# Altium schematic sheet SpinASM.SchDoc
size A
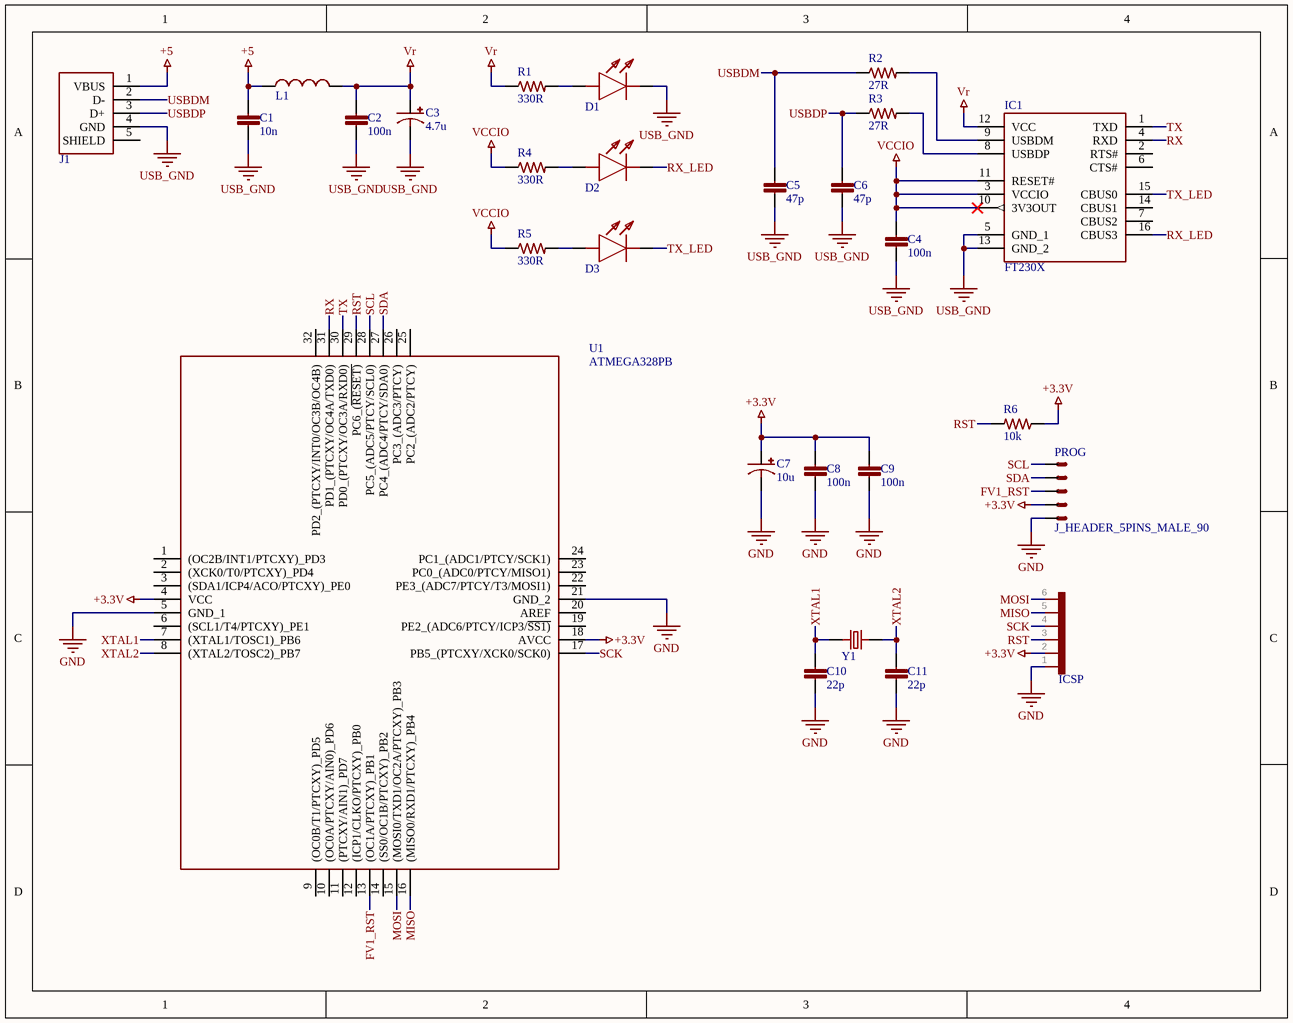
[diagram p0: SpinASM.SchDoc]

## Parts
C1  10n  [CHIP_0603]
C2  100n  [CHIP_0603]
C3  4.7u  [TAN_1206]
C4  100n  [CHIP_0603]
C5  47p  [CHIP_0603]
C6  47p  [CHIP_0603]
C7  10u  [TAN_1206]
C8  100n  [CHIP_0603]
C9  100n  [CHIP_0603]
C10  22p  [CHIP_0603]
C11  22p  [CHIP_0603]
D1  MP001249  [LED_0603]  (value not drawn)
D2  MP001249  [LED_0603]  (value not drawn)
D3  MP001249  [LED_0603]  (value not drawn)
IC1  FT230X  [TSSOP-16]
ICSP  ICSP  [AVRISP_POGO]  (value not drawn)
J1  USB_MALE  [USB_MALE]  (value not drawn)
L1  BLM18AG331SN1D  [INDC1608X10]  (value not drawn)
PROG  J_HEADER_5PINS_MALE_90  [HEADER_5PINS_MALE_90]
R1  330R  [CHIP_R_0603]
R2  27R  [CHIP_R_0603]
R3  27R  [CHIP_R_0603]
R4  330R  [CHIP_R_0603]
R5  330R  [CHIP_R_0603]
R6  10k  [CHIP_R_0603]
U1  ATMEGA328PB  [TQFP32]
Y1  ABM10  [ABM10-167]  (value not drawn)

## Nets
+3.3V: C7.+ C8.1 C9.1 ICSP.2(MOSI) PROG.2(S) R6.1 U1.4(VCC) U1.18(AVCC)
+5: C1.1 J1.1(VBUS) L1.2
GND: C7.- C8.2 C9.2 C10.2 C11.2 ICSP.1(~{RST}) PROG.1(S) U1.5(GND_1) U1.21(GND_2)
USB_GND: C1.2 C2.2 C3.- C4.2 C5.2 C6.2 D1.1(K) IC1.5(GND_1) IC1.13(GND_2) J1.4(GND)
VCCIO: C4.1 IC1.3(VCCIO) IC1.10(3V3OUT) IC1.11(RESET#) R4.1 R5.1
Vr: C2.1 C3.+ IC1.12(VCC) L1.1 R1.1
FV1_RST: PROG.3(S) U1.13((OC1A/PTCXY)_PB1)
MISO: ICSP.5(GND) U1.16((MISO0/RXD1/PTCXY)_PB4)
MOSI: ICSP.6(VCC) U1.15((MOSI0/TXD1/OC2A/PTCXY)_PB3)
RST: ICSP.3(MISO) R6.2 U1.29(PC6_(~{RESET)})
RX: IC1.4(RXD) U1.31(PD1_(PTCXY/OC4A/TXD0))
RX_LED: D2.1(K) IC1.16(CBUS3)
SCK: ICSP.4(SCK) U1.17(PB5_(PTCXY/XCK0/SCK0))
SCL: PROG.5(S) U1.28(PC5_(ADC5/PTCY/SCL0))
SDA: PROG.4(S) U1.27(PC4_(ADC4/PTCY/SDA0))
TX: IC1.1(TXD) U1.30(PD0_(PTCXY/OC3A/RXD0))
TX_LED: D3.1(K) IC1.15(CBUS0)
USBDM: C5.1 J1.2(D-) R2.1
USBDP: C6.1 J1.3(D+) R3.1
XTAL1: C10.1 U1.7((XTAL1/TOSC1)_PB6) Y1.1
XTAL2: C11.1 U1.8((XTAL2/TOSC2)_PB7) Y1.2
NetD1_2: D1.2(A) R1.2
NetD2_2: D2.2(A) R4.2
NetD3_2: D3.2(A) R5.2
NetIC1_8: IC1.8(USBDP) R3.2
NetIC1_9: IC1.9(USBDM) R2.2

Not connected (* = marked no-connect by the designer): IC1 2(RTS#) 6(CTS#) 7(CBUS2) 14(CBUS1); J1 5(SHIELD); U1 1((OC2B/INT1/PTCXY)_PD3) 2((XCK0/T0/PTCXY)_PD4) 3((SDA1/ICP4/ACO/PTCXY)_PE0) 6((SCL1/T4/PTCXY)_PE1) 9((OC0B/T1/PTCXY)_PD5) 10((OC0A/PTCXY/AIN0)_PD6) 11((PTCXY/AIN1)_PD7) 12((ICP1/CLKO/PTCXY)_PB0) 14((SS0/OC1B/PTCXY)_PB2) 19(PE2_(ADC6/PTCY/ICP3/~{SS1)}) 20(AREF) 22(PE3_(ADC7/PTCY/T3/MOSI1)) 23(PC0_(ADC0/PTCY/MISO1)) 24(PC1_(ADC1/PTCY/SCK1)) 25(PC2_(ADC2/PTCY)) 26(PC3_(ADC3/PTCY)) 32(PD2_(PTCXY/INT0/OC3B/OC4B))

## Library data of the parts
C1 = MC0603B103K500CT: CAP CER 10NF 50V X7R 0603; Manufacturer: Multicomp; Tolerance: 10%; Supplier 1: Farnell; Supplier Part Number 1: 1759102; Manufacturer Part Number: MC0603B103K500CT; RoHS: Yes; Category: Ceramic Capacitors; Stock 1: 112880; Case/Package: 0603; Number of Pins: 2; Case Code (Metric): 1608; Case Code (Imperial): 0603; Min Operating Temperature: -55°C; Max Operating Temperature: 125°C; Voltage Rating (DC): 50V; Dielectric: X7R; Capacitance: 10nF; Voltage Rating: 50V; Packaging: Tape and Reel; Width: 0.8mm; REACH SVHC: Unknown; ComponentLink1URL: https://datasheet.ciiva.com/22675/1901289-22675356.pdf?src-supplier=Element14; ComponentLink1Description: https://datasheet.ciiva.com/22675/1901289-22675356.pdf?src-supplier=Element14; ComponentLink2URL: https://datasheet.ciiva.com/22675/1901289-22675357.pdf?src-supplier=Element14; ComponentLink2Description: https://datasheet.ciiva.com/22675/1901289-22675357.pdf?src-supplier=Element14; Price: 0.0147
C2 C4 C8 C9 = MC0603B104K500CT: CAP CER 100NF 50V X7R 0603; Manufacturer: Multicomp; Tolerance: 10%; Supplier 1: Farnell; Supplier Part Number 1: 1759122; Manufacturer Part Number: MC0603B104K500CT; Stock 1: 1057763; RoHS: Yes; Case/Package: 0603; Number of Pins: 2; Case Code (Metric): 1608; Case Code (Imperial): 0603; Min Operating Temperature: -55°C; Max Operating Temperature: 125°C; Packaging: Cut Tape; Voltage Rating: 50V; Capacitance: 100nF; Dielectric: X7R; Voltage Rating (DC): 50V; REACH SVHC: Unknown; ComponentLink1URL: https://datasheet.ciiva.com/22686/1901289-22686278.pdf?src-supplier=Element14; ComponentLink1Description: https://datasheet.ciiva.com/22686/1901289-22686278.pdf?src-supplier=Element14; ComponentLink2URL: https://datasheet.ciiva.com/22686/1901289-22686279.pdf?src-supplier=Element14; ComponentLink2Description: https://datasheet.ciiva.com/22686/1901289-22686279.pdf?src-supplier=Element14; ComponentLink3URL: https://datasheet.ciiva.com/22648/1901289-22648411.pdf?src-supplier=Element14; ComponentLink3Description: https://datasheet.ciiva.com/22648/1901289-22648411.pdf?src-supplier=Element14; Price: 0.0458
C3 = T491A475K010AT: CAP TANT 4.7UF 10V; Manufacturer: KEMET; Dielectric Material: Tantalum; Tolerance: 20%; ESR (Equivalent Series Resistance): 5R; Life (Hours): 2000Hour; Leakage Current: 500nA; Dissipation Factor: 6%; Polarity: Polar; Ripple Current: 122mA; Supplier 1: Farnell; Supplier Part Number 1: 1457427; Manufacturer Part Number: T491A475K010AT; RoHS: Yes; Category: Tantalum Capacitors; Stock 1: 5135; Mount: Surface Mount,PCB; Case/Package: 1206; Number of Pins: 2; Case Code (Metric): 3216; Case Code (Imperial): 1206; Min Operating Temperature: -55°C; Max Operating Temperature: 125°C; Capacitance: 4.7uF; Packaging: Tape and Reel; Voltage Rating: 10V; Features: General Purpose; Termination: SMD/SMT; Voltage Rating (DC): 10V; Voltage: 10V; Package Quantity: 1; Length: 3.2mm; Height: 1.6mm; Depth: 1.6mm; Width: 1.6mm; Height - Seated (Max): 0.071inch; Lead Pitch: 1.2mm; Radiation Hardening: No; Lead Free: Lead Free; REACH SVHC: No SVHC; ComponentLink1URL: https://datasheet.ciiva.com/257/kem-t2005-t491-257408.pdf?src-supplier=Digi-Key; ComponentLink1Description: https://datasheet.ciiva.com/257/kem-t2005-t491-257408.pdf?src-supplier=Digi-Key; ComponentLink2URL: https://datasheet.ciiva.com/7668/1732747-7668019.pdf?src-supplier=Element14; ComponentLink2Description: https://datasheet.ciiva.com/7668/1732747-7668019.pdf?src-supplier=Element14; ComponentLink3URL: https://datasheet.ciiva.com/27052/1573417-27052564.pdf?src-supplier=Jameco; ComponentLink3Description: https://datasheet.ciiva.com/27052/1573417-27052564.pdf?src-supplier=Jameco; ComponentLink4URL: https://datasheet.ciiva.com/14589/70095774-14589016.pdf?src-supplier=Allied+Electronics; ComponentLink4Description: https://datasheet.ciiva.com/14589/70095774-14589016.pdf?src-supplier=Allied+Electronics; ComponentLink5URL: https://datasheet.ciiva.com/257/kem-t2005-t491-257409.pdf?src-supplier=Digi-Key; ComponentLink5Description: https://datasheet.ciiva.com/257/kem-t2005-t491-257409.pdf?src-supplier=Digi-Key; ComponentLink6URL: https://datasheet.ciiva.com/7668/1446014-7668021.pdf?src-supplier=Element14; ComponentLink6Description: https://datasheet.ciiva.com/7668/1446014-7668021.pdf?src-supplier=Element14; ComponentLink7URL: https://datasheet.ciiva.com/14588/70095774-14588348.pdf?src-supplier=Allied+Electronics; ComponentLink7Description: https://datasheet.ciiva.com/14588/70095774-14588348.pdf?src-supplier=Allied+Electronics; ComponentLink8URL: https://datasheet.ciiva.com/257/kem-t2005-t491-257407.pdf?src-supplier=Digi-Key; ComponentLink8Description: https://datasheet.ciiva.com/257/kem-t2005-t491-257407.pdf?src-supplier=Digi-Key; Price: 0.241
C5 C6 = MC0603N470J500CT: CAP CER 47PF 50V C0G/NP0 0603; Manufacturer: Multicomp; Tolerance: 5%; Dielectric: C0G; Temperature Coefficient: 30ppm/°C; Supplier 1: Farnell; Supplier Part Number 1: 1759062; Manufacturer Part Number: MC0603N470J500CT; Stock: 148629; Pricing: 10=0.0246, 100=0.0199, 500=0.0123, 1000=0.0097, 2000=0.0089 (EUR); RoHS: Yes; Case/Package: 0603; Number of Pins: 2; Case Code (Metric): 1608; Case Code (Imperial): 0603; Min Operating Temperature: -55°C; Max Operating Temperature: 125°C; Packaging: Tape and Reel; Voltage Rating: 50V; Capacitance: 47pF; Voltage Rating (DC): 50V; Width: 0.8mm; REACH SVHC: Unknown; ComponentLink1URL: https://datasheet.ciiva.com/22648/1901289-22648503.pdf?src-supplier=Element14; ComponentLink1Description: https://datasheet.ciiva.com/22648/1901289-22648503.pdf?src-supplier=Element14; ComponentLink2URL: https://datasheet.ciiva.com/22682/1901289-22682812.pdf?src-supplier=Element14; ComponentLink2Description: https://datasheet.ciiva.com/22682/1901289-22682812.pdf?src-supplier=Element14; ComponentLink3URL: https://datasheet.ciiva.com/22682/1901289-22682813.pdf?src-supplier=Element14; ComponentLink3Description: https://datasheet.ciiva.com/22682/1901289-22682813.pdf?src-supplier=Element14; Price: 0.02
C7 = T491A106K016AT: CAP TANT 10UF 16V; Manufacturer: KEMET; Dielectric Material: Tantalum; Tolerance: 10%; ESR (Equivalent Series Resistance): 7R; Life (Hours): 2000Hour; Polarity: Polar; Leakage Current: 1.6uA; Ripple Current: 104mA; Supplier 1: Farnell; Supplier Part Number 1: 1457414; Manufacturer Part Number: T491A106K016AT; RoHS: Yes; Category: Tantalum Capacitors; Stock: 36020; Pricing: 5=0.30300, 50=0.16000, 250=0.13300, 500=0.12000, 1000=0.10200 (EUR); Mount: Surface Mount,PCB; Case/Package: 1206; Number of Pins: 2; Case Code (Metric): 3216; Case Code (Imperial): 1206; Min Operating Temperature: -55°C; Max Operating Temperature: 125°C; Capacitance: 10uF; Packaging: Tape and Reel; Voltage Rating: 16V; Features: General Purpose; Dissipation Factor: 10%; Package Quantity: 1; Voltage Rating (DC): 16V; Termination: SMD/SMT; Failure Rate: 0.001%; Voltage: 16V; Length: 3.2mm; Height: 1.6mm; Width: 1.6mm; Depth: 1.6mm; Height - Seated (Max): 0.071inch; Lead Pitch: 1.2mm; Radiation Hardening: No; Lead Free: Lead Free; REACH SVHC: No SVHC; ComponentLink1URL: https://datasheet.ciiva.com/7696/1732745-7696294.pdf?src-supplier=Element14; ComponentLink1Description: https://datasheet.ciiva.com/7696/1732745-7696294.pdf?src-supplier=Element14; ComponentLink2URL: https://datasheet.ciiva.com/34302/1573257-34302505.pdf?src-supplier=Jameco; ComponentLink2Description: https://datasheet.ciiva.com/34302/1573257-34302505.pdf?src-supplier=Jameco; ComponentLink3URL: https://datasheet.ciiva.com/7696/1854511-7696293.pdf?src-supplier=Element14; ComponentLink3Description: https://datasheet.ciiva.com/7696/1854511-7696293.pdf?src-supplier=Element14; ComponentLink4URL: https://datasheet.ciiva.com/14586/70095774-14586694.pdf?src-supplier=Allied+Electronics; ComponentLink4Description: https://datasheet.ciiva.com/14586/70095774-14586694.pdf?src-supplier=Allied+Electronics; ComponentLink5URL: https://datasheet.ciiva.com/6248/kem-t2005-t491-6248087.pdf?src-supplier=Digi-Key; ComponentLink5Description: https://datasheet.ciiva.com/6248/kem-t2005-t491-6248087.pdf?src-supplier=Digi-Key; ComponentLink6URL: https://datasheet.ciiva.com/6248/kem-t2005-t491-6248088.pdf?src-supplier=Digi-Key; ComponentLink6Description: https://datasheet.ciiva.com/6248/kem-t2005-t491-6248088.pdf?src-supplier=Digi-Key; ComponentLink7URL: https://datasheet.ciiva.com/14113/t491serie-eng-tds-14113132.pdf?src-supplier=Distrelec; ComponentLink7Description: https://datasheet.ciiva.com/14113/t491serie-eng-tds-14113132.pdf?src-supplier=Distrelec; ComponentLink8URL: https://datasheet.ciiva.com/7696/1923792-7696431.pdf?src-supplier=Element14; ComponentLink8Description: https://datasheet.ciiva.com/7696/1923792-7696431.pdf?src-supplier=Element14; ComponentLink9URL: https://datasheet.ciiva.com/7696/1854511-7696295.pdf?src-supplier=Element14; ComponentLink9Description: https://datasheet.ciiva.com/7696/1854511-7696295.pdf?src-supplier=Element14; ComponentLink10URL: https://datasheet.ciiva.com/14605/70095774-14605543.pdf?src-supplier=Allied+Electronics; ComponentLink10Description: https://datasheet.ciiva.com/14605/70095774-14605543.pdf?src-supplier=Allied+Electronics; ComponentLink11URL: https://datasheet.ciiva.com/7696/1446014-7696296.pdf?src-supplier=Element14; ComponentLink11Description: https://datasheet.ciiva.com/7696/1446014-7696296.pdf?src-supplier=Element14; ComponentLink12URL: https://datasheet.ciiva.com/6248/kem-t2005-t491-6248089.pdf?src-supplier=Digi-Key; ComponentLink12Description: https://datasheet.ciiva.com/6248/kem-t2005-t491-6248089.pdf?src-supplier=Digi-Key; ComponentLink13URL: https://datasheet.ciiva.com/12882/kem-t2005-t491-12882730.pdf?src-supplier=Mouser; ComponentLink13Description: https://datasheet.ciiva.com/12882/kem-t2005-t491-12882730.pdf?src-supplier=Mouser; ComponentLink14URL: https://datasheet.ciiva.com/39123/kem-t2005-t491-39123278.pdf?src-supplier=Onlinecomponents.com; ComponentLink14Description: https://datasheet.ciiva.com/39123/kem-t2005-t491-39123278.pdf?src-supplier=Onlinecomponents.com; ComponentLink15URL: https://datasheet.ciiva.com/29244/458306-da-01-de-kondensator-10uf-3216-10pr-16v-85c-29244588.pdf?src-supplier=Conrad; ComponentLink15Description: https://datasheet.ciiva.com/29244/458306-da-01-de-kondensator-10uf-3216-10pr-16v-85c-29244588.pdf?src-supplier=Conrad; Price: 0.167
C10 C11 = MC0603N220J500CT: CAP CER 22PF 50V C0G/NP0 0603; Manufacturer: Multicomp; Temperature Coefficient: 30ppm/°C; Dielectric: C0G; Tolerance: 5%; Supplier 1: Farnell; Supplier Part Number 1: 1759057; Manufacturer Part Number: MC0603N220J500CT; RoHS: Yes; Category: Ceramic Capacitors; Stock: 53792; Case/Package: 0603; Number of Pins: 2; Case Code (Imperial): 0603; Case Code (Metric): 1608; Min Operating Temperature: -55°C; Max Operating Temperature: 125°C; Voltage Rating (DC): 50V; Capacitance: 22pF; Voltage Rating: 50V; Packaging: Cut Tape; Width: 0.8mm; REACH SVHC: Unknown; ComponentLink1URL: https://datasheet.ciiva.com/22648/1901289-22648486.pdf?src-supplier=Element14; ComponentLink1Description: https://datasheet.ciiva.com/22648/1901289-22648486.pdf?src-supplier=Element14; Price: 0.024
D1-D3 = MP001249: LED RED CMS 603 20 mA 2.5 V 629 nm; Manufacturer: Multicomp; Supplier 1: Farnell; Supplier Part Number 1: 3265380; Manufacturer Part Number: MP001249; RoHS: No; Price: 0.0718
IC1 = FT230XS-R: USB-to-UART 1-CH 512byte FIFO 5V 16-Pin SSOP T/R; Manufacturer: FTDI; Data Rate: 12Mbps; Number of Channels: 1; Max Supply Voltage: 5.5V; Min Supply Voltage: 2.97V; Interface: UART,USB; Operating Supply Current: 8mA; Supplier 1: Farnell; Supplier Part Number 1: 2081321; Manufacturer Part Number: FT230XS-R; RoHS: Yes; Category: Interface ICs; Stock 1: 45264; Mount: Surface Mount; Case/Package: SSOP; Number of Pins: 16; Weight: 0.004586oz; Min Operating Temperature: -40°C; Max Operating Temperature: 85°C; Packaging: Tape and Reel; Package Quantity: 3000; Operating Supply Voltage: 5V; Length: 5mm; Height: 0.059inch; Width: 0.157inch; ComponentLink1URL: https://datasheet.ciiva.com/1787/ds-ft230x-1787315.pdf?src-supplier=Digi-Key; ComponentLink1Description: https://datasheet.ciiva.com/1787/ds-ft230x-1787315.pdf?src-supplier=Digi-Key; ComponentLink2URL: https://datasheet.ciiva.com/4787/ds-ft230x-5395-4787571.pdf?src-supplier=Mouser; ComponentLink2Description: https://datasheet.ciiva.com/4787/ds-ft230x-5395-4787571.pdf?src-supplier=Mouser; ComponentLink3URL: https://datasheet.ciiva.com/30478/0900766b811020cb-30478167.pdf?src-supplier=RSComponents; ComponentLink3Description: https://datasheet.ciiva.com/30478/0900766b811020cb-30478167.pdf?src-supplier=RSComponents; ComponentLink4URL: https://datasheet.ciiva.com/1787/ft-x-series-1787316.pdf?src-supplier=Digi-Key; ComponentLink4Description: https://datasheet.ciiva.com/1787/ft-x-series-1787316.pdf?src-supplier=Digi-Key; ComponentLink5URL: https://datasheet.ciiva.com/1787/ft-x-series-1787317.pdf?src-supplier=Digi-Key; ComponentLink5Description: https://datasheet.ciiva.com/1787/ft-x-series-1787317.pdf?src-supplier=Digi-Key; Price: 1.94
ICSP = AVRISP_POGO
J1 = 48037-2200: USB Connectors USB A PLUG SMT STR S SHELL LEG 3.8mm L/F; Manufacturer: Molex; Number of Ports: 1; Number of Contacts: 4; Connector Type: USB,Plug; Max Voltage Rating (AC): 150V; Insulation Resistance: 1GR; Gender: Male; Current Rating: 1.5A; Pitch: 2mm; Supplier 1: Farnell; Supplier Part Number 1: 2313729; Manufacturer Part Number: 48037-2200; RoHS: Yes; Category: Connectors; Stock: 1058; Mount: Surface Mount; Number of Terminals: 4; Housing Material: Nylon; Contact Plating: Gold; Contact Material: Brass; Color: Black; Min Operating Temperature: -20°C; Max Operating Temperature: 85°C; Termination: Solder; Orientation: Right Angle; Packaging: Tape and Reel; Voltage Rating: 150V; Number of Rows: 1; Number of Circuits: 4; Voltage Rating (AC): 150V; Radiation Hardening: No; REACH SVHC: Unknown; Halogen Free: Low Halogen; ComponentLink1URL: https://datasheet.ciiva.com/22654/1701284-22654928.pdf?src-supplier=Element14; ComponentLink1Description: https://datasheet.ciiva.com/22654/1701284-22654928.pdf?src-supplier=Element14; ComponentLink2URL: https://datasheet.ciiva.com/16148/1690390480372200-io-nectors-16148911.pdf?src-supplier=Onlinecomponents.com; ComponentLink2Description: https://datasheet.ciiva.com/16148/1690390480372200-io-nectors-16148911.pdf?src-supplier=Onlinecomponents.com; ComponentLink3URL: https://datasheet.ciiva.com/4598/0480372200-io-connectors-146329-4598955.pdf?src-supplier=Mouser; ComponentLink3Description: https://datasheet.ciiva.com/4598/0480372200-io-connectors-146329-4598955.pdf?src-supplier=Mouser; ComponentLink4URL: https://datasheet.ciiva.com/30049/331280480372200-io-nectors-30049803.pdf?src-supplier=Onlinecomponents.com; ComponentLink4Description: https://datasheet.ciiva.com/30049/331280480372200-io-nectors-30049803.pdf?src-supplier=Onlinecomponents.com; ComponentLink5URL: https://datasheet.ciiva.com/16667/0480372200-io-connectors-16667879.pdf?src-supplier=Avnet+Europe; ComponentLink5Description: https://datasheet.ciiva.com/16667/0480372200-io-connectors-16667879.pdf?src-supplier=Avnet+Europe; Price: 0.794
L1 = BLM18AG331SN1D: MURATA         BLM18AG331SN1D            FERRITE BEAD, 0.3OHM, 500MA, 0603; Material: Ferrite,Steel; Impedance: 330R; Tolerance: 25%; DC Resistance (DCR): 300mR; Test Frequency: 100MHz; Number of Lines: 1; Shielding: Unshielded; Supplier 1: Farnell; Supplier Part Number 1: 1515675; Manufacturer: Murata; Manufacturer Part Number: BLM18AG331SN1D; RoHS: Yes; Category: Inductors; Stock 1: 4308; Case/Package: 0603; Number of Pins: 2; Core Material: Ferrite; Case Code (Metric): 1608; Case Code (Imperial): 0603; Min Operating Temperature: -55°C; Max Operating Temperature: 125°C; Max DC Current: 500mA; Package Quantity: 1; Max Current Rating: 500mA; Packaging: Tape and Reel; Current Rating: 500mA; ESR (Equivalent Series Resistance): 330R; Termination: SMD/SMT; Number of Circuits: 1; Length: 1.6mm; Height: 0.8mm; Width: 0.8mm; Depth: 0.8mm; REACH SVHC: No SVHC; Lead Free: Lead Free; ComponentLink1URL: https://datasheet.ciiva.com/1466/356366-1466928.pdf?src-supplier=Element14; ComponentLink1Description: https://datasheet.ciiva.com/1466/356366-1466928.pdf?src-supplier=Element14; ComponentLink2URL: https://datasheet.ciiva.com/19458/1844740-19458419.pdf?src-supplier=Jameco; ComponentLink2Description: https://datasheet.ciiva.com/19458/1844740-19458419.pdf?src-supplier=Jameco; ComponentLink3URL: https://datasheet.ciiva.com/18093/getdatasheetpartid-220856-18093188.pdf?src-supplier=Verical; ComponentLink3Description: https://datasheet.ciiva.com/18093/getdatasheetpartid-220856-18093188.pdf?src-supplier=Verical; ComponentLink4URL: https://datasheet.ciiva.com/11800/0900766b811b5866-11800887.pdf?src-supplier=RSComponents; ComponentLink4Description: https://datasheet.ciiva.com/11800/0900766b811b5866-11800887.pdf?src-supplier=RSComponents; ComponentLink5URL: https://datasheet.ciiva.com/41449/001171689-da-01-en-chip-drossel0603-330r-500ma-1-6x0-8mm-41449370.pdf?src-supplier=Conrad; ComponentLink5Description: https://datasheet.ciiva.com/41449/001171689-da-01-en-chip-drossel0603-330r-500ma-1-6x0-8mm-41449370.pdf?src-supplier=Conrad; ComponentLink6URL: https://datasheet.ciiva.com/41449/001172225-da-01-en-drossel-0603-330r-1-6x0-8mm-4000st-41449519.pdf?src-supplier=Conrad; ComponentLink6Description: https://datasheet.ciiva.com/41449/001172225-da-01-en-drossel-0603-330r-1-6x0-8mm-4000st-41449519.pdf?src-supplier=Conrad; ComponentLink7URL: https://datasheet.ciiva.com/16420/l0110s0100blm18a-16420761.pdf?src-supplier=Future+Electronics; ComponentLink7Description: https://datasheet.ciiva.com/16420/l0110s0100blm18a-16420761.pdf?src-supplier=Future+Electronics; ComponentLink8URL: https://datasheet.ciiva.com/1012/l0110s0100blm18a-1012044.pdf?src-supplier=Digi-Key; ComponentLink8Description: https://datasheet.ciiva.com/1012/l0110s0100blm18a-1012044.pdf?src-supplier=Digi-Key; ComponentLink9URL: https://datasheet.ciiva.com/3081/l0110s0100blm18a-3081612.pdf?src-supplier=Avnet; ComponentLink9Description: https://datasheet.ciiva.com/3081/l0110s0100blm18a-3081612.pdf?src-supplier=Avnet; ComponentLink10URL: https://datasheet.ciiva.com/1012/l0110s0100blm18a-1012045.pdf?src-supplier=Digi-Key; ComponentLink10Description: https://datasheet.ciiva.com/1012/l0110s0100blm18a-1012045.pdf?src-supplier=Digi-Key; ComponentLink11URL: https://datasheet.ciiva.com/17279/l0110s0100blm18a-17279501.pdf?src-supplier=Avnet+Europe; ComponentLink11Description: https://datasheet.ciiva.com/17279/l0110s0100blm18a-17279501.pdf?src-supplier=Avnet+Europe; ComponentLink12URL: https://datasheet.ciiva.com/1012/l0110s0100blm18a-1012046.pdf?src-supplier=Digi-Key; ComponentLink12Description: https://datasheet.ciiva.com/1012/l0110s0100blm18a-1012046.pdf?src-supplier=Digi-Key; ComponentLink13URL: https://datasheet.ciiva.com/1466/356366-1466927.pdf?src-supplier=Element14; ComponentLink13Description: https://datasheet.ciiva.com/1466/356366-1466927.pdf?src-supplier=Element14; Price: 0.0361
R1 R4 R5 = CRCW0603330RFKEA: RES SMD 330R OHM 1% 1/10W 0603; Manufacturer: Vishay; Temperature Coefficient: 100ppm/°C; Power Rating: 100mW; Voltage Rating: 75V; Supplier 1: Farnell; Supplier Part Number 1: 1469803; Manufacturer Part Number: CRCW0603330RFKEA; RoHS: Yes; Category: Chip SMD Resistors; Stock: 92220; Pricing: 10=0.04600, 100=0.01830, 500=0.01570, 1000=0.00710, 2500=0.00550 (EUR); Mount: Surface Mount; Case/Package: 0603; Weight: 7.1E-05oz; Contact Plating: Tin; Case Code (Metric): 1608; Case Code (Imperial): 0603; Min Operating Temperature: -55°C; Max Operating Temperature: 155°C; Composition: Thick Film; Resistance: 330R; Tolerance: 1%; Termination: SMD/SMT; Packaging: Tape and Reel; Package Quantity: 10; Number of Terminations: 2; Military Standard: Not; Max Power Dissipation: 100mW; Voltage Rating (DC): 75V; Features: Automotive AEC-Q200; Length: 1.55mm; Height: 0.45mm; Width: 0.033inch; Depth: 0.85mm; Radiation Hardening: No; Lead Free: Lead Free; REACH SVHC: Unknown; ComponentLink1URL: https://datasheet.ciiva.com/11809/0900766b80d98afc-11809055.pdf?src-supplier=RSComponents; ComponentLink1Description: https://datasheet.ciiva.com/11809/0900766b80d98afc-11809055.pdf?src-supplier=RSComponents; ComponentLink2URL: https://datasheet.ciiva.com/2465/dcrcwe3-2465777.pdf?src-supplier=Digi-Key; ComponentLink2Description: https://datasheet.ciiva.com/2465/dcrcwe3-2465777.pdf?src-supplier=Digi-Key; ComponentLink3URL: https://datasheet.ciiva.com/2465/dcrcwe3-2465778.pdf?src-supplier=Digi-Key; ComponentLink3Description: https://datasheet.ciiva.com/2465/dcrcwe3-2465778.pdf?src-supplier=Digi-Key; ComponentLink4URL: https://datasheet.ciiva.com/2465/dcrcwe3-2465779.pdf?src-supplier=Digi-Key; ComponentLink4Description: https://datasheet.ciiva.com/2465/dcrcwe3-2465779.pdf?src-supplier=Digi-Key; ComponentLink5URL: https://datasheet.ciiva.com/5543/dcrcwe3-109170-5543013.pdf?src-supplier=Mouser; ComponentLink5Description: https://datasheet.ciiva.com/5543/dcrcwe3-109170-5543013.pdf?src-supplier=Mouser; ComponentLink6URL: https://datasheet.ciiva.com/16772/70201119-16772038.pdf?src-supplier=Allied+Electronics; ComponentLink6Description: https://datasheet.ciiva.com/16772/70201119-16772038.pdf?src-supplier=Allied+Electronics; ComponentLink7URL: https://datasheet.ciiva.com/26316/fld-crcw-e3-data-en-26316538.pdf?src-supplier=Distrelec; ComponentLink7Description: https://datasheet.ciiva.com/26316/fld-crcw-e3-data-en-26316538.pdf?src-supplier=Distrelec; ComponentLink8URL: https://datasheet.ciiva.com/15225/getdatasheetpartid-32830-15225339.pdf?src-supplier=Verical; ComponentLink8Description: https://datasheet.ciiva.com/15225/getdatasheetpartid-32830-15225339.pdf?src-supplier=Verical; ComponentLink9URL: https://datasheet.ciiva.com/16372/dcrcwe3-16372971.pdf?src-supplier=Future+Electronics; ComponentLink9Description: https://datasheet.ciiva.com/16372/dcrcwe3-16372971.pdf?src-supplier=Future+Electronics; ComponentLink10URL: https://datasheet.ciiva.com/16893/dcrcwe3-16893227.pdf?src-supplier=Avnet+Europe; ComponentLink10Description: https://datasheet.ciiva.com/16893/dcrcwe3-16893227.pdf?src-supplier=Avnet+Europe; ComponentLink11URL: https://datasheet.ciiva.com/7777/1697337-7777311.pdf?src-supplier=Element14; ComponentLink11Description: https://datasheet.ciiva.com/7777/1697337-7777311.pdf?src-supplier=Element14; Price: 0.0626
R2 R3 = CRCW060327R0FKEA: RES SMD 27 OHM 1% 1/10W 0603; Manufacturer: Vishay; Power Rating: 100mW; Temperature Coefficient: 100ppm/°C; Voltage Rating: 75V; Supplier 1: Farnell; Supplier Part Number 1: 2141211; Manufacturer Part Number: CRCW060327R0FKEA; RoHS: Yes; Category: Chip SMD Resistors; Stock 1: 1183; Mount: Surface Mount; Case/Package: 0603; Number of Pins: 2; Weight: 7.1E-05oz; Contact Plating: Tin; Case Code (Imperial): 0603; Case Code (Metric): 1608; Min Operating Temperature: -55°C; Max Operating Temperature: 155°C; Resistance: 27R; Tolerance: 1%; Composition: Thick Film; Packaging: Tape and Reel; Termination: SMD/SMT; Package Quantity: 5000; Military Standard: Not; Voltage Rating (DC): 75V; Length: 1.55mm; Height: 0.45mm; Width: 0.85mm; Depth: 0.85mm; Radiation Hardening: No; REACH SVHC: Unknown; Lead Free: Lead Free; ComponentLink1URL: https://datasheet.ciiva.com/11809/0900766b80d98afc-11809194.pdf?src-supplier=RSComponents; ComponentLink1Description: https://datasheet.ciiva.com/11809/0900766b80d98afc-11809194.pdf?src-supplier=RSComponents; ComponentLink2URL: https://datasheet.ciiva.com/5541/dcrcwe3-109170-5541782.pdf?src-supplier=Mouser; ComponentLink2Description: https://datasheet.ciiva.com/5541/dcrcwe3-109170-5541782.pdf?src-supplier=Mouser; ComponentLink3URL: https://datasheet.ciiva.com/7792/125364-7792167.pdf?src-supplier=Element14; ComponentLink3Description: https://datasheet.ciiva.com/7792/125364-7792167.pdf?src-supplier=Element14; ComponentLink4URL: https://datasheet.ciiva.com/22704/1697337-22704440.pdf?src-supplier=Element14; ComponentLink4Description: https://datasheet.ciiva.com/22704/1697337-22704440.pdf?src-supplier=Element14; ComponentLink5URL: https://datasheet.ciiva.com/7672/1697337-7672889.pdf?src-supplier=Element14; ComponentLink5Description: https://datasheet.ciiva.com/7672/1697337-7672889.pdf?src-supplier=Element14; ComponentLink6URL: https://datasheet.ciiva.com/7672/1697337-7672890.pdf?src-supplier=Element14; ComponentLink6Description: https://datasheet.ciiva.com/7672/1697337-7672890.pdf?src-supplier=Element14; ComponentLink7URL: https://datasheet.ciiva.com/16882/dcrcwe3-16882811.pdf?src-supplier=Avnet+Europe; ComponentLink7Description: https://datasheet.ciiva.com/16882/dcrcwe3-16882811.pdf?src-supplier=Avnet+Europe; ComponentLink8URL: https://datasheet.ciiva.com/22870/70201119-22870860.pdf?src-supplier=Allied+Electronics; ComponentLink8Description: https://datasheet.ciiva.com/22870/70201119-22870860.pdf?src-supplier=Allied+Electronics; ComponentLink9URL: https://datasheet.ciiva.com/16498/dcrcwe3-16498302.pdf?src-supplier=Future+Electronics; ComponentLink9Description: https://datasheet.ciiva.com/16498/dcrcwe3-16498302.pdf?src-supplier=Future+Electronics; ComponentLink10URL: https://datasheet.ciiva.com/16780/70201119-16780479.pdf?src-supplier=Allied+Electronics; ComponentLink10Description: https://datasheet.ciiva.com/16780/70201119-16780479.pdf?src-supplier=Allied+Electronics; Price: 0.0181
R6 = CRCW060310K0FKEA: RES SMD 10K OHM 1% 1/10W 0603; Manufacturer: Vishay; Resistance: 10kR; Temperature Coefficient: 100ppm/°C; Power Rating: 100mW; Voltage Rating: 75V; Supplier 1: Farnell; Supplier Part Number 1: 1469748; Manufacturer Part Number: CRCW060310K0FKEA; Stock: 1391124; Pricing: 10=0.0169, 100=0.013, 500=0.0113, 1000=0.008 (EUR); RoHS: Yes; Case/Package: 0603; Number of Pins: 2; Weight: 7.1E-05oz; Contact Plating: Tin; Case Code (Metric): 1608; Case Code (Imperial): 0603; Min Operating Temperature: -55°C; Max Operating Temperature: 155°C; Tolerance: 1%; Composition: Thick Film; Packaging: Tape and Reel; Package Quantity: 10; Number of Terminations: 2; Military Standard: Not; Termination: SMD/SMT; Max Power Dissipation: 100mW; Voltage Rating (DC): 75V; Features: Automotive AEC-Q200; Length: 1.55mm; Height: 0.45mm; Width: 0.033inch; Depth: 0.85mm; Radiation Hardening: No; Lead Free: Lead Free; REACH SVHC: Unknown; ComponentLink1URL: https://datasheet.ciiva.com/11809/0900766b80d98afc-11809037.pdf?src-supplier=RSComponents; ComponentLink1Description: https://datasheet.ciiva.com/11809/0900766b80d98afc-11809037.pdf?src-supplier=RSComponents; ComponentLink2URL: https://datasheet.ciiva.com/16886/dcrcw-16886037.pdf?src-supplier=Avnet+Europe; ComponentLink2Description: https://datasheet.ciiva.com/16886/dcrcw-16886037.pdf?src-supplier=Avnet+Europe; ComponentLink3URL: https://datasheet.ciiva.com/26821/getdatasheetpartid-86831-26821109.pdf?src-supplier=Verical; ComponentLink3Description: https://datasheet.ciiva.com/26821/getdatasheetpartid-86831-26821109.pdf?src-supplier=Verical; ComponentLink4URL: https://datasheet.ciiva.com/16754/70201119-16754710.pdf?src-supplier=Allied+Electronics; ComponentLink4Description: https://datasheet.ciiva.com/16754/70201119-16754710.pdf?src-supplier=Allied+Electronics; ComponentLink5URL: https://datasheet.ciiva.com/16719/70201119-16719704.pdf?src-supplier=Allied+Electronics; ComponentLink5Description: https://datasheet.ciiva.com/16719/70201119-16719704.pdf?src-supplier=Allied+Electronics; ComponentLink6URL: https://datasheet.ciiva.com/2465/dcrcwe3-2465513.pdf?src-supplier=Digi-Key; ComponentLink6Description: https://datasheet.ciiva.com/2465/dcrcwe3-2465513.pdf?src-supplier=Digi-Key; ComponentLink7URL: https://datasheet.ciiva.com/5543/dcrcwe3-109170-5543001.pdf?src-supplier=Mouser; ComponentLink7Description: https://datasheet.ciiva.com/5543/dcrcwe3-109170-5543001.pdf?src-supplier=Mouser; ComponentLink8URL: https://datasheet.ciiva.com/2465/dcrcwe3-2465514.pdf?src-supplier=Digi-Key; ComponentLink8Description: https://datasheet.ciiva.com/2465/dcrcwe3-2465514.pdf?src-supplier=Digi-Key; ComponentLink9URL: https://datasheet.ciiva.com/46385/1697337-46385498.pdf?src-supplier=Element14; ComponentLink9Description: https://datasheet.ciiva.com/46385/1697337-46385498.pdf?src-supplier=Element14; ComponentLink10URL: https://datasheet.ciiva.com/2465/dcrcwe3-2465515.pdf?src-supplier=Digi-Key; ComponentLink10Description: https://datasheet.ciiva.com/2465/dcrcwe3-2465515.pdf?src-supplier=Digi-Key; ComponentLink11URL: https://datasheet.ciiva.com/3256/dcrcwe3-3256939.pdf?src-supplier=Avnet; ComponentLink11Description: https://datasheet.ciiva.com/3256/dcrcwe3-3256939.pdf?src-supplier=Avnet; ComponentLink12URL: https://datasheet.ciiva.com/3256/dcrcwe3-3256940.pdf?src-supplier=Avnet; ComponentLink12Description: https://datasheet.ciiva.com/3256/dcrcwe3-3256940.pdf?src-supplier=Avnet; ComponentLink13URL: https://datasheet.ciiva.com/16209/dcrcwe3-16209164.pdf?src-supplier=Future+Electronics; ComponentLink13Description: https://datasheet.ciiva.com/16209/dcrcwe3-16209164.pdf?src-supplier=Future+Electronics; ComponentLink14URL: https://datasheet.ciiva.com/26314/fld-crcw-e3-data-en-26314749.pdf?src-supplier=Distrelec; ComponentLink14Description: https://datasheet.ciiva.com/26314/fld-crcw-e3-data-en-26314749.pdf?src-supplier=Distrelec; Price: 0.0131
U1 = ATMEGA328PB-AU: IC MCU 8BIT 32KB FLASH 32TQFP; Manufacturer: Microchip; Supplier 1: Farnell; Supplier Part Number 1: 2523203; Manufacturer Part Number: ATMEGA328PB-AU; RoHS: No; Category: Microcontrollers; Stock 1: 2845; Case/Package: TQFP; ComponentLink1URL: http://www.farnell.com/datasheets/2915218.pdf?src-supplier=Farnell; ComponentLink1Description: http://www.farnell.com/datasheets/2915218.pdf?src-supplier=Farnell; ComponentLink2URL: http://www.farnell.com/datasheets/2915218.pdf?src-supplier=Newark; ComponentLink2Description: http://www.farnell.com/datasheets/2915218.pdf?src-supplier=Newark; ComponentLink3URL: http://www.microchip.com/mymicrochip/filehandler.aspx?ddocname=en589666&src-supplier=Digi-Key; ComponentLink3Description: http://www.microchip.com/mymicrochip/filehandler.aspx?ddocname=en589666&src-supplier=Digi-Key; Price: 1.26
Y1 = ABM10-166-12.000MHZ-T3: CRYSTAL 12 MHz SMD 28 pF 10 ppm; Manufacturer: Abracon; Frequency Stability: 10ppm; Frequency: 12MHz; Load Capacitance: 8pF; ESR (Equivalent Series Resistance): 125R; Supplier 1: Farnell; Supplier Part Number 1: 2849406; Manufacturer Part Number: ABM10-166-12.000MHZ-T3; RoHS: Yes; Category: Crystals; Stock: 5674; Mount: Surface Mount; Case/Package: SMD/SMT; Min Operating Temperature: -20°C; Max Operating Temperature: 70°C; Frequency Tolerance: 10ppm; Packaging: Tape and Reel; Length: 0.098inch; Height: 0.02inch; Width: 0.079inch; ComponentLink1URL: http://www.farnell.com/datasheets/2581417.pdf?src-supplier=Farnell; ComponentLink1Description: http://www.farnell.com/datasheets/2581417.pdf?src-supplier=Farnell; ComponentLink2URL: https://abracon.com/Resonators/ABM10-XXX_packagedrawing.PDF?src-supplier=Digi-Key; ComponentLink2Description: https://abracon.com/Resonators/ABM10-XXX_packagedrawing.PDF?src-supplier=Digi-Key; Price: 0.41